# EAGLE design FlyballETS-SENSORS (EAGLE 8.2.2)
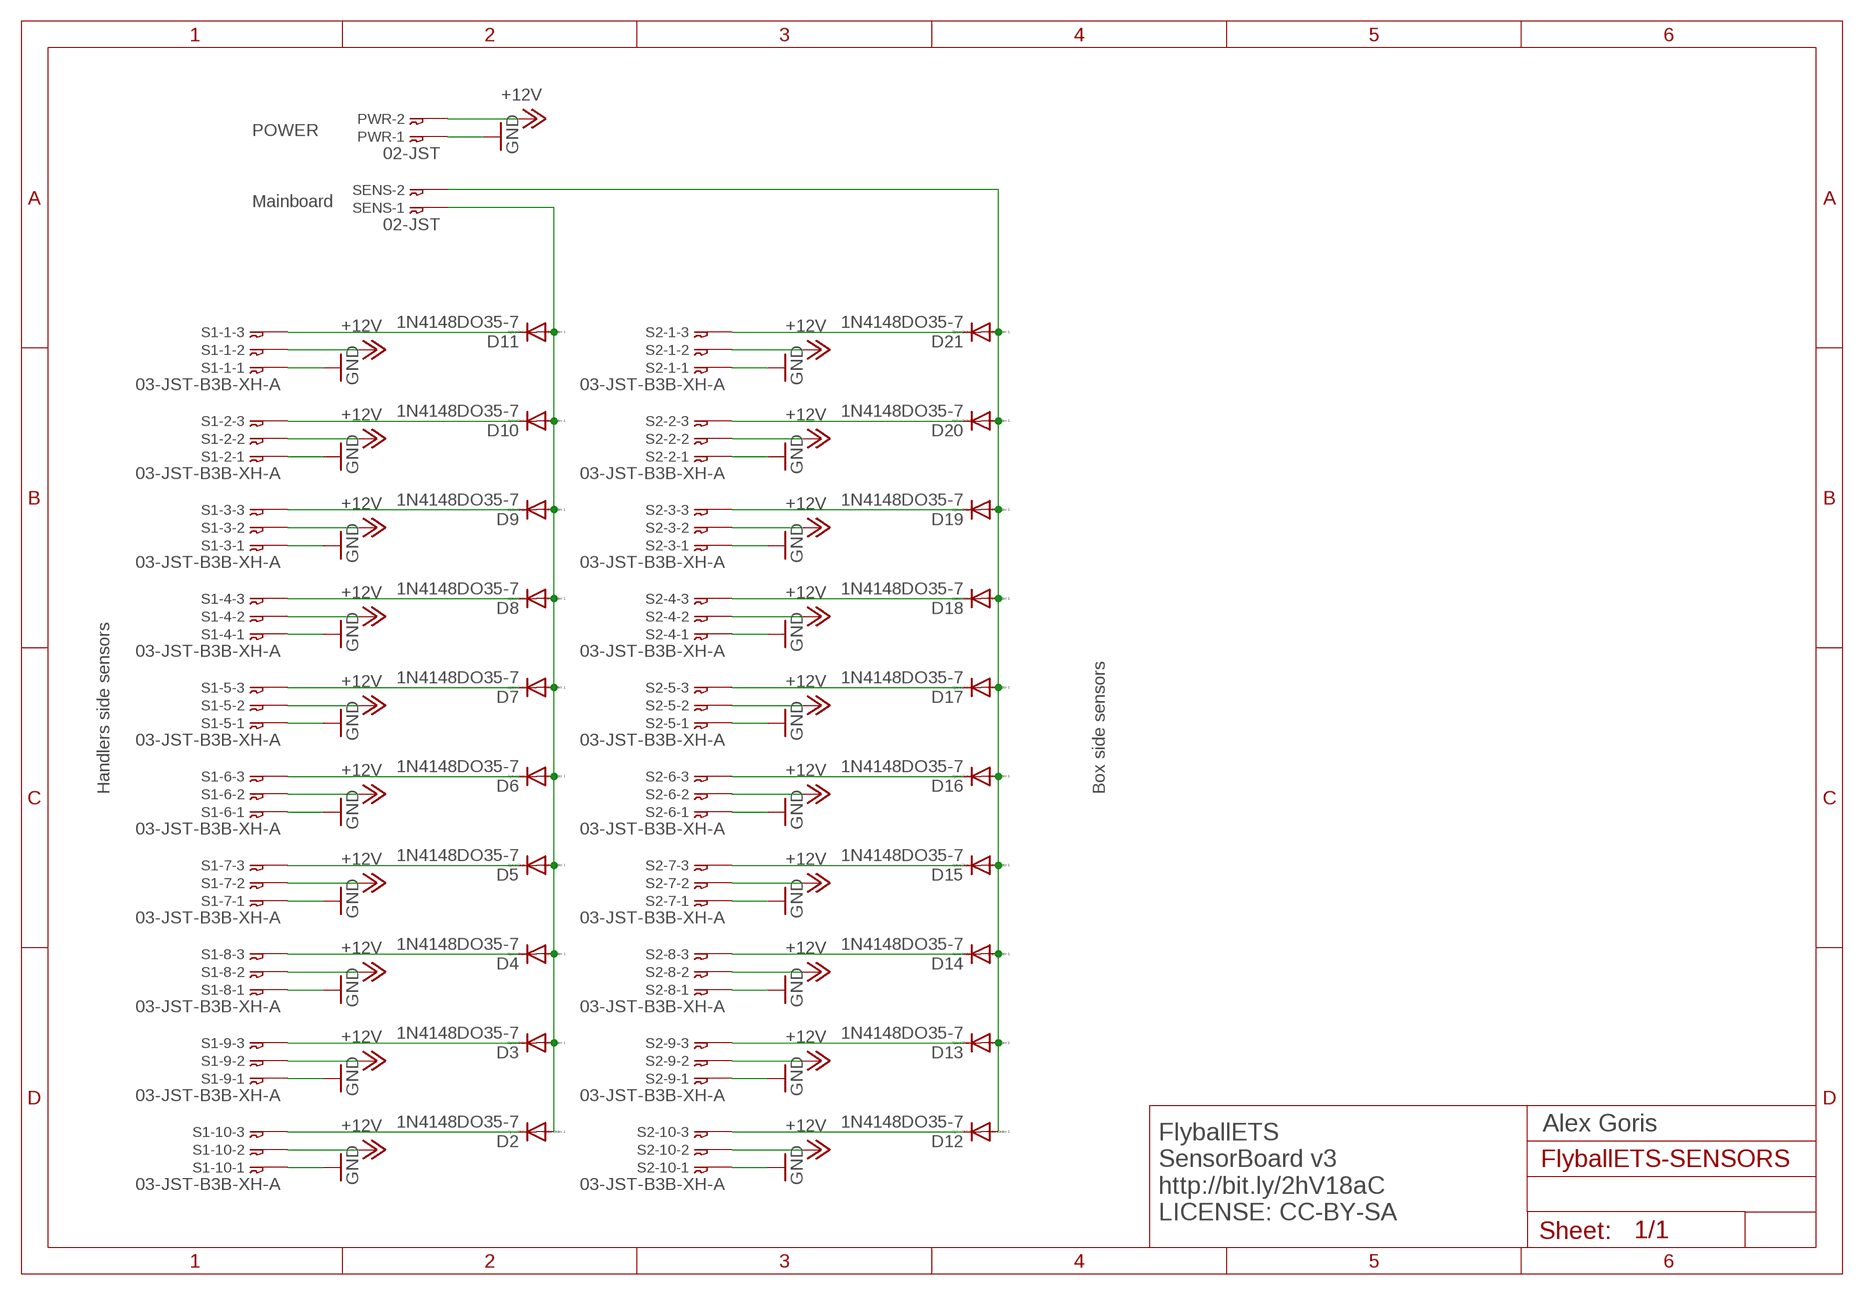
[diagram p0: schematic, sheet 1]

## Parts
D2  1N4148DO35-7  [DO35-7]
D3  1N4148DO35-7  [DO35-7]
D4  1N4148DO35-7  [DO35-7]
D5  1N4148DO35-7  [DO35-7]
D6  1N4148DO35-7  [DO35-7]
D7  1N4148DO35-7  [DO35-7]
D8  1N4148DO35-7  [DO35-7]
D9  1N4148DO35-7  [DO35-7]
D10  1N4148DO35-7  [DO35-7]
D11  1N4148DO35-7  [DO35-7]
D12  1N4148DO35-7  [DO35-7]
D13  1N4148DO35-7  [DO35-7]
D14  1N4148DO35-7  [DO35-7]
D15  1N4148DO35-7  [DO35-7]
D16  1N4148DO35-7  [DO35-7]
D17  1N4148DO35-7  [DO35-7]
D18  1N4148DO35-7  [DO35-7]
D19  1N4148DO35-7  [DO35-7]
D20  1N4148DO35-7  [DO35-7]
D21  1N4148DO35-7  [DO35-7]
PWR  02-JST  [B2B-XH]
S1-1  03-JST-B3B-XH-A  [B3B-XH]
S1-2  03-JST-B3B-XH-A  [B3B-XH]
S1-3  03-JST-B3B-XH-A  [B3B-XH]
S1-4  03-JST-B3B-XH-A  [B3B-XH]
S1-5  03-JST-B3B-XH-A  [B3B-XH]
S1-6  03-JST-B3B-XH-A  [B3B-XH]
S1-7  03-JST-B3B-XH-A  [B3B-XH]
S1-8  03-JST-B3B-XH-A  [B3B-XH]
S1-9  03-JST-B3B-XH-A  [B3B-XH]
S1-10  03-JST-B3B-XH-A  [B3B-XH]
S2-1  03-JST-B3B-XH-A  [B3B-XH]
S2-2  03-JST-B3B-XH-A  [B3B-XH]
S2-3  03-JST-B3B-XH-A  [B3B-XH]
S2-4  03-JST-B3B-XH-A  [B3B-XH]
S2-5  03-JST-B3B-XH-A  [B3B-XH]
S2-6  03-JST-B3B-XH-A  [B3B-XH]
S2-7  03-JST-B3B-XH-A  [B3B-XH]
S2-8  03-JST-B3B-XH-A  [B3B-XH]
S2-9  03-JST-B3B-XH-A  [B3B-XH]
S2-10  03-JST-B3B-XH-A  [B3B-XH]
SENS  02-JST  [B2B-XH]

## Nets
+12V: PWR.P$2 S1-1.P$2 S1-2.P$2 S1-3.P$2 S1-4.P$2 S1-5.P$2 S1-6.P$2 S1-7.P$2 S1-8.P$2 S1-9.P$2 S1-10.P$2 S2-1.P$2 S2-2.P$2 S2-3.P$2 S2-4.P$2 S2-5.P$2 S2-6.P$2 S2-7.P$2 S2-8.P$2 S2-9.P$2 S2-10.P$2
GND: PWR.P$1 S1-1.P$1 S1-2.P$1 S1-3.P$1 S1-4.P$1 S1-5.P$1 S1-6.P$1 S1-7.P$1 S1-8.P$1 S1-9.P$1 S1-10.P$1 S2-1.P$1 S2-2.P$1 S2-3.P$1 S2-4.P$1 S2-5.P$1 S2-6.P$1 S2-7.P$1 S2-8.P$1 S2-9.P$1 S2-10.P$1
N$1: D11.C S1-1.P$3
N$2: D10.C S1-2.P$3
N$3: D9.C S1-3.P$3
N$4: D8.C S1-4.P$3
N$5: D7.C S1-5.P$3
N$6: D6.C S1-6.P$3
N$7: D5.C S1-7.P$3
N$8: D4.C S1-8.P$3
N$9: D3.C S1-9.P$3
N$10: D2.C S1-10.P$3
N$11: D21.C S2-1.P$3
N$12: D20.C S2-2.P$3
N$13: D19.C S2-3.P$3
N$14: D18.C S2-4.P$3
N$15: D17.C S2-5.P$3
N$16: D16.C S2-6.P$3
N$17: D15.C S2-7.P$3
N$18: D14.C S2-8.P$3
N$19: D13.C S2-9.P$3
N$20: D12.C S2-10.P$3
S1: D12.A D13.A D14.A D15.A D16.A D17.A D18.A D19.A D20.A D21.A SENS.P$2
S2: D2.A D3.A D4.A D5.A D6.A D7.A D8.A D9.A D10.A D11.A SENS.P$1

## Notes on the sheet
- POWER
- Mainboard
- Handlers side sensors | Box side sensors
- Alex Goris
- FlyballETS
  SensorBoard v3
  http://bit.ly/2hV18aC
  LICENSE: CC-BY-SA

## Library data of the parts
D2-D21 = diode:1N4148: DIODE high speed (Philips)
PWR SENS = bt_con-jst-xh:02-JST: JST CONNECTOR
S1-1-S1-10 S2-1-S2-10 = bt_con-jst-xh:03-JST: JST CONNECTOR

## Board
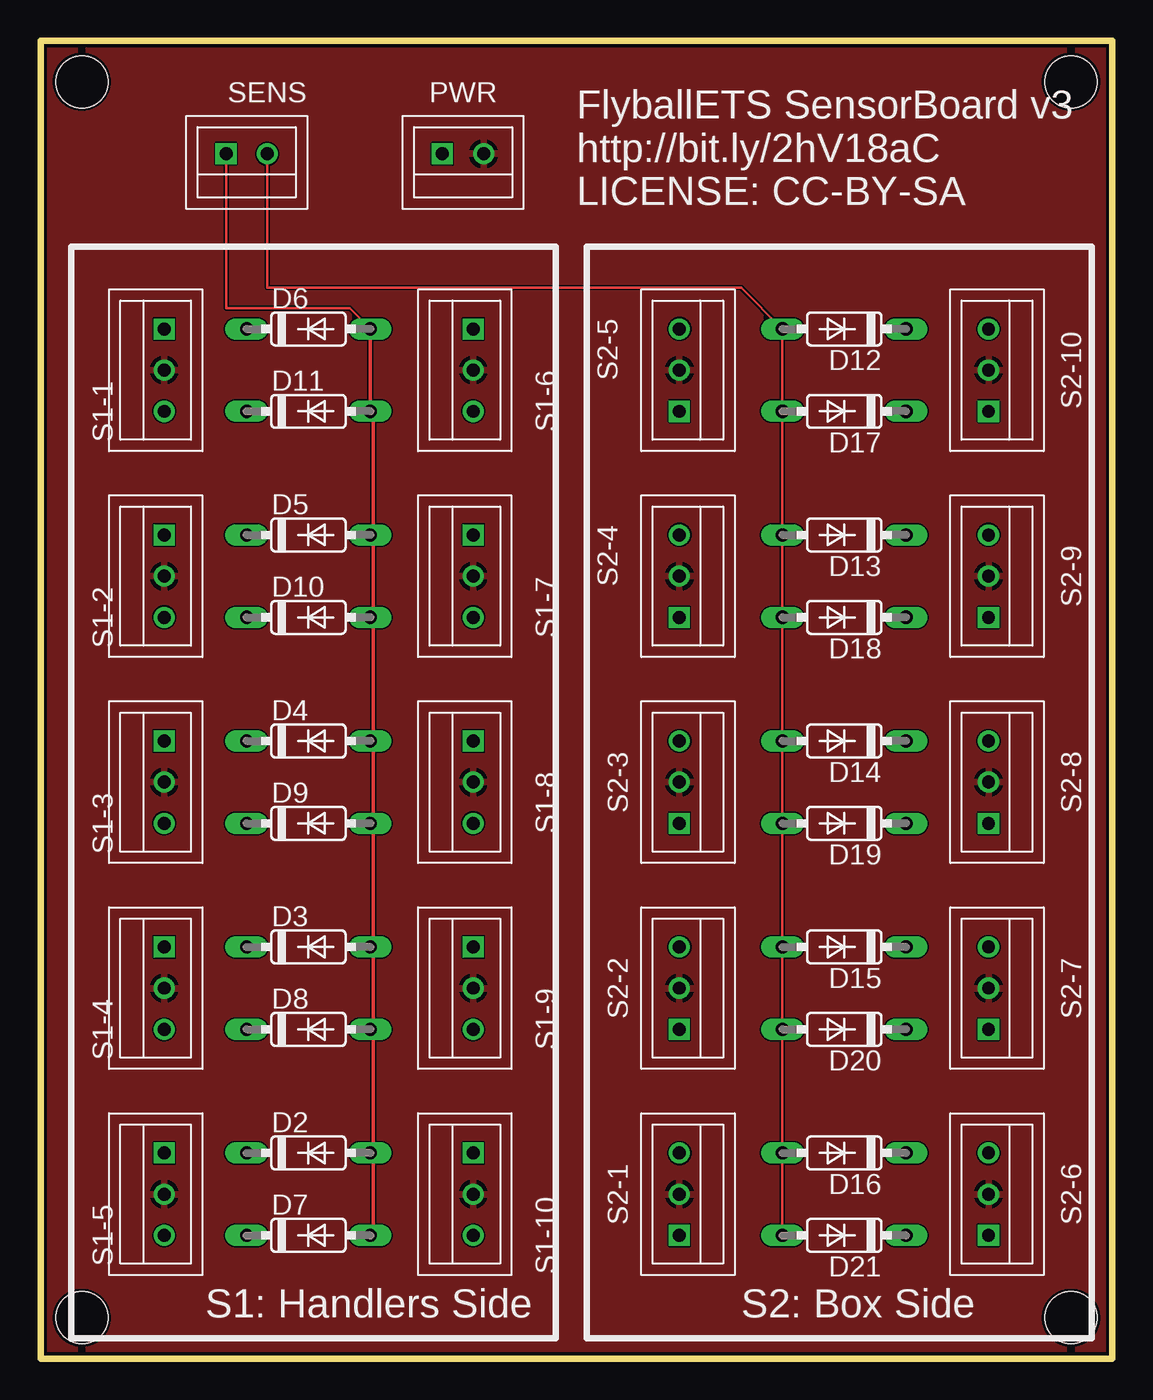
[diagram p1: board, top side]
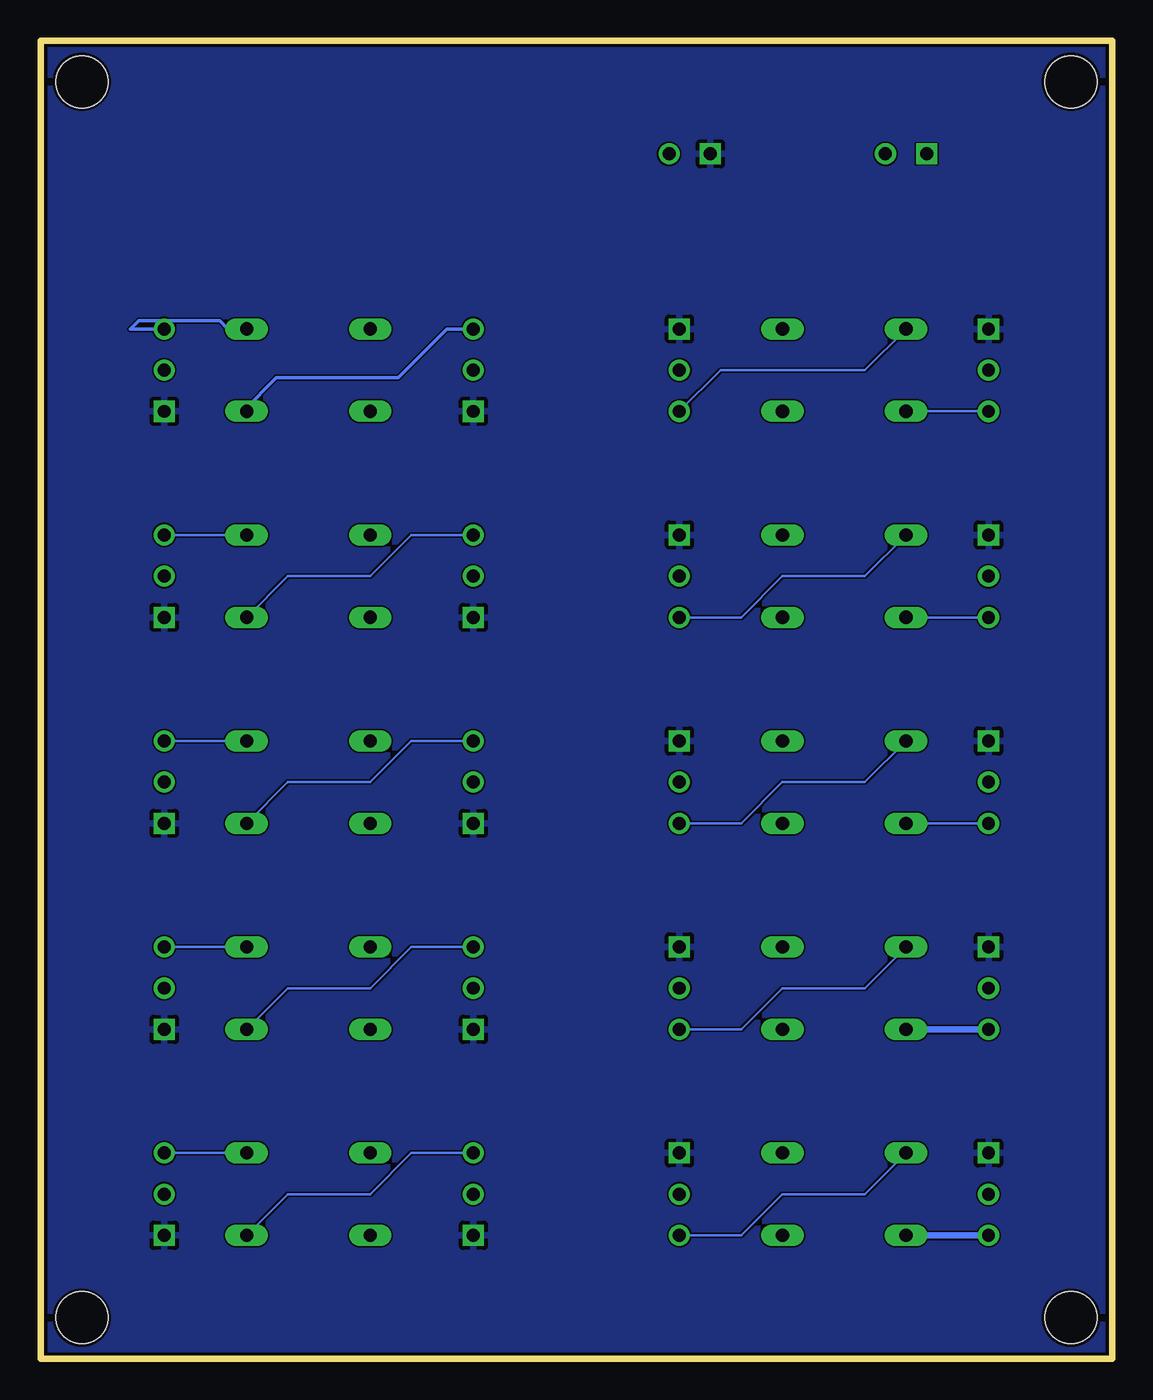
[diagram p2: board, bottom side, seen from below]

Size 66.04 x 81.28 mm. Coordinates in mm from the lower left corner, seen from the top.
Outline: 0,0 0,81.28 66.04,81.28 66.04,0 0,0
Copper layers (1*16): Top 0.035mm / dielectric 1.5mm / Bottom 0.035mm
Design rules "aisler_go_2layer": minimum track width 0.1mm, minimum drill 0.2mm, track to track 0.1mm, track to pad 0.1mm, pad to pad 0.1mm, via to via 0.1mm, smd to smd 0.1mm, copper to edge 0.2mm, drill to drill 0.21mm, minimum pad ring 0.25mm, minimum via ring 0.05mm, stop-mask expansion 0.05mm, vias tented up to drill 0mil, thermal gap 10mil
Holes 3.2 mm at 2.54,78.74 63.5,78.74 63.5,2.54 2.54,2.54

### Footprints (pad centres in the part's own frame; a part is rotated, then mirrored left to right if it is on the bottom)
DO35-7 = drill 0.813 long: A 3.81,0; C -3.81,0
B2B-XH = drill 0.8 square: P$1 2.54,0 | drill 0.8: P$2 0,0
B3B-XH = drill 0.8 square: P$1 2.54,0 | drill 0.8: P$2 0,0; P$3 -2.54,0

### Placement (x,y rotation side)
D2  16.51,12.7 0 top
D3  16.51,25.4 0 top
D4  16.51,38.1 0 top
D5  16.51,50.8 0 top
D6  16.51,63.5 0 top
D7  16.51,7.62 0 top
D8  16.51,20.32 0 top
D9  16.51,33.02 0 top
D10  16.51,45.72 0 top
D11  16.51,58.42 0 top
D12  49.53,63.5 180 top
D13  49.53,50.8 180 top
D14  49.53,38.1 180 top
D15  49.53,25.4 180 top
D16  49.53,12.7 180 top
D17  49.53,58.42 180 top
D18  49.53,45.72 180 top
D19  49.53,33.02 180 top
D20  49.53,20.32 180 top
D21  49.53,7.62 180 top
PWR  27.3,74.3 180 top
S1-1  7.62,60.96 90 top
S1-2  7.62,48.26 90 top
S1-3  7.62,35.56 90 top
S1-4  7.62,22.86 90 top
S1-5  7.62,10.16 90 top
S1-6  26.67,60.96 90 top
S1-7  26.67,48.26 90 top
S1-8  26.67,35.56 90 top
S1-9  26.67,22.86 90 top
S1-10  26.67,10.16 90 top
S2-1  39.37,10.16 270 top
S2-2  39.37,22.86 270 top
S2-3  39.37,35.56 270 top
S2-4  39.37,48.26 270 top
S2-5  39.37,60.96 270 top
S2-6  58.42,10.16 270 top
S2-7  58.42,22.86 270 top
S2-8  58.42,35.56 270 top
S2-9  58.42,48.26 270 top
S2-10  58.42,60.96 270 top
SENS  13.97,74.3 180 top
U$1  [A5L-LOC]  -33.02,-27.94 0 top  (outside the outline)

### Tracks (layer width: path | path; a pad name or v marks a point on that pad's centre or on a via)
+12V
  pour Top: 0,0 0,81.28 66.04,81.28 66.04,0
GND
  pour Bottom: 0,0 0,81.28 66.04,81.28 66.04,0
N$1
  Bottom 0.152: S1-1.P$3 D11.C
N$2
  Bottom 0.152: S1-2.P$3 D10.C
N$3
  Bottom 0.152: S1-3.P$3 D9.C
N$4
  Bottom 0.406: D8.C S1-4.P$3
N$5
  Bottom 0.406: D7.C S1-5.P$3
N$6
  Bottom 0.152: D6.C 15.24,60.96 24.13,60.96 S1-6.P$3
N$7
  Bottom 0.152: D5.C 15.24,48.26 20.32,48.26 22.86,45.72 S1-7.P$3
N$8
  Bottom 0.152: D4.C 15.24,35.56 20.32,35.56 22.86,33.02 S1-8.P$3
N$9
  Bottom 0.152: D3.C 15.24,22.86 20.32,22.86 22.86,20.32 S1-9.P$3
N$10
  Bottom 0.152: D2.C 15.24,10.16 20.32,10.16 22.86,7.62 S1-10.P$3
N$11
  Bottom 0.152: S2-1.P$3 43.18,12.7 45.72,10.16 50.8,10.16 D21.C
N$12
  Bottom 0.152: S2-2.P$3 43.18,25.4 45.72,22.86 50.8,22.86 D20.C
N$13
  Bottom 0.152: S2-3.P$3 43.18,38.1 45.72,35.56 50.8,35.56 D19.C
N$14
  Bottom 0.152: S2-4.P$3 43.18,50.8 45.72,48.26 50.8,48.26 D18.C
N$15
  Bottom 0.203: S2-5.P$3 41,63.5 44,60.5 51.5,60.5 53.5,58.5 D17.C
N$16
  Bottom 0.152: D16.C S2-6.P$3
N$17
  Bottom 0.152: D15.C S2-7.P$3
N$18
  Bottom 0.152: D14.C S2-8.P$3
N$19
  Bottom 0.152: D13.C S2-9.P$3
N$20
  Bottom 0.203: D12.C 54.5,63.5 55,64 60,64 60.5,63.5 S2-10.P$3
S1
  Top 0.152: 14.06,66.04 13.97,66.04 | 14.06,66.04 43.18,66.04 D12.A D17.A D13.A D18.A D14.A D19.A D15.A D20.A D16.A D21.A | SENS.P$2 13.97,66.13 14.06,66.04
S2
  Top 0.152: SENS.P$1 11.43,64.77 19.05,64.77 D6.A
  Top 0.203: D7.A 20.5,8 20.5,12.5 D2.A 20.5,13 20.5,20 D8.A 20.5,20.5 20.5,25 D3.A 20.5,25.5 20.5,33 D9.A 20.5,33.5 20.5,38 D4.A 20.5,38.5 20.5,45.5 D10.A 20.5,46 20.5,50.5 D5.A 20.5,51 20.5,58 D11.A D6.A

### Text on the board
tPlace: FlyballETS SensorBoard v3 / http://bit.ly/2hV18aC / LICENSE: CC-BY-SA | S1: Handlers Side | S2: Box Side
Document: Alex Goris | FlyballETS / SensorBoard v3 / http://bit.ly/2hV18aC / LICENSE: CC-BY-SA | Units: mm